# Altium schematic sheet VT_WRP.SchDoc
size A
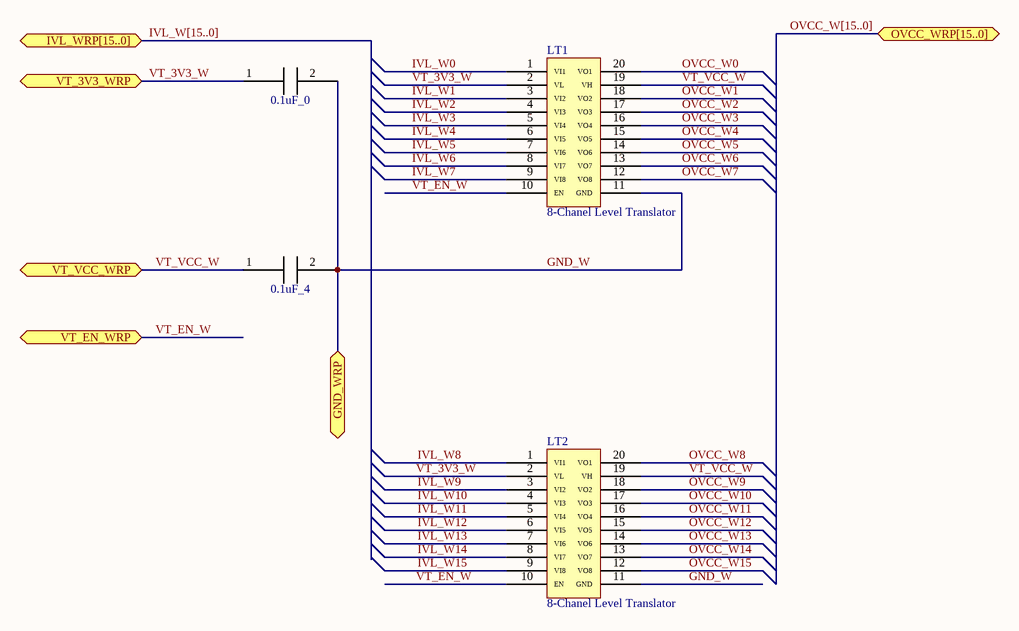
[diagram p0: VT_WRP.SchDoc]

## Parts
0.1uF_0  0.1uF_0603  [0.1uF_0603]  (value not drawn)
0.1uF_4  0.1uF_0603  [0.1uF_0603]  (value not drawn)
LT1  8-Chanel Level Translator  [8-bit_level]
LT2  8-Chanel Level Translator  [8-bit_level]

## Ports
GND_WRP, IVL_WRP[15..0], OVCC_WRP[15..0], VT_3V3_WRP, VT_EN_WRP, VT_VCC_WRP

## Nets
GND_W: 0.1uF_0.2 0.1uF_4.2 LT1.11(GND) LT2.11(GND) ; port GND_WRP
IVL_W0: LT1.1(VI1)
IVL_W1: LT1.3(VI2)
IVL_W2: LT1.4(VI3)
IVL_W3: LT1.5(VI4)
IVL_W4: LT1.6(VI5)
IVL_W5: LT1.7(VI6)
IVL_W6: LT1.8(VI7)
IVL_W7: LT1.9(VI8)
IVL_W8: LT2.1(VI1)
IVL_W9: LT2.3(VI2)
IVL_W10: LT2.4(VI3)
IVL_W11: LT2.5(VI4)
IVL_W12: LT2.6(VI5)
IVL_W13: LT2.7(VI6)
IVL_W14: LT2.8(VI7)
IVL_W15: LT2.9(VI8)
OVCC_W0: LT1.20(VO1)
OVCC_W1: LT1.18(VO2)
OVCC_W2: LT1.17(VO3)
OVCC_W3: LT1.16(VO4)
OVCC_W4: LT1.15(VO5)
OVCC_W5: LT1.14(VO6)
OVCC_W6: LT1.13(VO7)
OVCC_W7: LT1.12(VO8)
OVCC_W8: LT2.20(VO1)
OVCC_W9: LT2.18(VO2)
OVCC_W10: LT2.17(VO3)
OVCC_W11: LT2.16(VO4)
OVCC_W12: LT2.15(VO5)
OVCC_W13: LT2.14(VO6)
OVCC_W14: LT2.13(VO7)
OVCC_W15: LT2.12(VO8)
VT_3V3_W: 0.1uF_0.1 LT1.2(VL) LT2.2(VL) ; port VT_3V3_WRP
VT_EN_W: LT1.10(EN) LT2.10(EN) ; port VT_EN_WRP
VT_VCC_W: 0.1uF_4.1 LT1.19(VH) LT2.19(VH) ; port VT_VCC_WRP

## Buses and harness runs
bus IVL_W[15..0] = port IVL_WRP[15..0]
bus OVCC_W[15..0] = port OVCC_WRP[15..0]

## Library data of the parts
LT1 LT2 = 8-Chanel Level Translator: IC XLATR LEVEL BIDIR 8CH 20TSSOP; Manufacturer: Maxim Integrated; Manufacturer Part Number: MAX3008EUP+; Translator Type: Voltage Level; Channel Type: Unidirectional; Number of Circuits: 1; Channels per Circuit: 8; Voltage - VCCA: 1.2 V ~ 5.5 V; Voltage - VCCB: 1.65 V ~ 5.5 V; Output Type: Tri-State, Non-Inverted; Data Rate: 35Mbps; Supplier 1: Digi-Key; RoHS: RoHS Compliant; Category: Integrated Circuits (ICs); Stock 1: 36; Pricing 1: 1=3.17, 10=3.012, 25=2.81, 50=2.7158 (USD); Packaging: Tube; Input Signal: -; Output Signal: -; Operating Temperature: -40°C ~ 85°C (TA); Features: Power Supply Decoupling; Mounting Type: Surface Mount; Package / Case: 20-TSSOP (0.173", 4.40mm Width); Supplier Device Package: 20-TSSOP; ComponentLink1URL: http://datasheets.maximintegrated.com/en/ds/MAX3000E-MAX3012.pdf; ComponentLink1Description: http://datasheets.maximintegrated.com/en/ds/MAX3000E-MAX3012.pdf; Supplier Part Number 1: MAX3008EUP+-ND